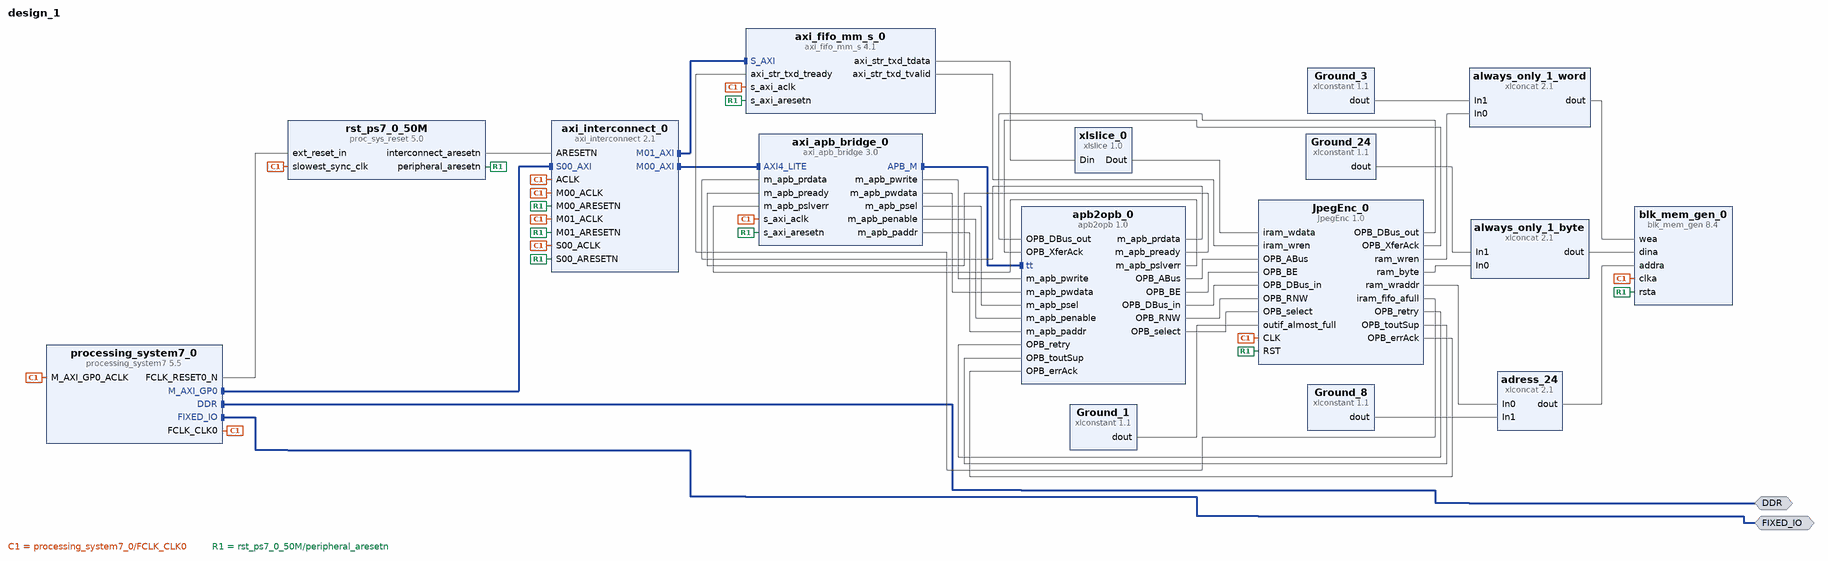
[diagram p0: block diagram of the top level]
# Vivado block design design_1, xc7z020clg400-1, Vivado 2017.4
create_bd_design design_1

create_bd_intf_port -mode Master -vlnv xilinx.com:interface:ddrx_rtl:1.0 DDR
create_bd_intf_port -mode Master -vlnv xilinx.com:display_processing_system7:fixedio_rtl:1.0 FIXED_IO

create_bd_cell -type ip -vlnv xilinx.com:ip:processing_system7:5.5 processing_system7_0
set_property -dict [list \
  CONFIG.PCW_UIPARAM_DDR_FREQ_MHZ 533.333333 \
  CONFIG.PCW_APU_PERIPHERAL_FREQMHZ 667 \
  CONFIG.PCW_SDIO_PERIPHERAL_FREQMHZ 50 \
  CONFIG.PCW_UART_PERIPHERAL_FREQMHZ 100 \
  CONFIG.PCW_PRESET_BANK1_VOLTAGE {LVCMOS 1.8V} \
  CONFIG.PCW_UIPARAM_DDR_MEMORY_TYPE {DDR 3 (Low Voltage)} \
  CONFIG.PCW_UIPARAM_DDR_PARTNO {MT41K256M16 RE-125} \
  CONFIG.PCW_QSPI_PERIPHERAL_ENABLE 1 \
  CONFIG.PCW_QSPI_QSPI_IO {MIO 1 .. 6} \
  CONFIG.PCW_QSPI_GRP_SINGLE_SS_ENABLE 1 \
  CONFIG.PCW_QSPI_GRP_SINGLE_SS_IO {MIO 1 .. 6} \
  CONFIG.PCW_SINGLE_QSPI_DATA_MODE x4 \
  CONFIG.PCW_QSPI_GRP_FBCLK_ENABLE 1 \
  CONFIG.PCW_QSPI_GRP_FBCLK_IO {MIO 8} \
  CONFIG.PCW_ENET0_PERIPHERAL_ENABLE 1 \
  CONFIG.PCW_ENET0_ENET0_IO {MIO 16 .. 27} \
  CONFIG.PCW_ENET0_GRP_MDIO_ENABLE 1 \
  CONFIG.PCW_ENET0_GRP_MDIO_IO {MIO 52 .. 53} \
  CONFIG.PCW_ENET_RESET_ENABLE 1 \
  CONFIG.PCW_ENET_RESET_SELECT {Share reset pin} \
  CONFIG.PCW_ENET0_RESET_ENABLE 0 \
  CONFIG.PCW_SD0_PERIPHERAL_ENABLE 1 \
  CONFIG.PCW_SD0_SD0_IO {MIO 40 .. 45} \
  CONFIG.PCW_SD0_GRP_CD_ENABLE 1 \
  CONFIG.PCW_SD0_GRP_CD_IO {MIO 47} \
  CONFIG.PCW_SD0_GRP_WP_ENABLE 0 \
  CONFIG.PCW_UART1_PERIPHERAL_ENABLE 1 \
  CONFIG.PCW_UART1_UART1_IO {MIO 48 .. 49} \
  CONFIG.PCW_USB0_PERIPHERAL_ENABLE 1 \
  CONFIG.PCW_USB0_USB0_IO {MIO 28 .. 39} \
  CONFIG.PCW_USB_RESET_ENABLE 1 \
  CONFIG.PCW_USB_RESET_SELECT {Share reset pin} \
  CONFIG.PCW_USB0_RESET_ENABLE 1 \
  CONFIG.PCW_USB0_RESET_IO {MIO 46} \
  CONFIG.PCW_I2C_RESET_ENABLE 1 \
  CONFIG.PCW_GPIO_MIO_GPIO_ENABLE 1 \
  CONFIG.PCW_GPIO_MIO_GPIO_IO MIO \
] [get_bd_cells processing_system7_0]
# 296 more settings of processing_system7_0 are not shown: defaults, MIO pin electricals, DDR timing, and values the tool derives
create_bd_cell -type ip -vlnv xilinx.com:ip:axi_interconnect:2.1 axi_interconnect_0
create_bd_cell -type ip -vlnv xilinx.com:ip:axi_apb_bridge:3.0 axi_apb_bridge_0
set_property -dict {CONFIG.C_APB_NUM_SLAVES 1} [get_bd_cells axi_apb_bridge_0]
create_bd_cell -type ip -vlnv xilinx.com:ip:proc_sys_reset:5.0 rst_ps7_0_50M
create_bd_cell -type ip -vlnv xilinx.com:ip:axi_fifo_mm_s:4.1 axi_fifo_mm_s_0
set_property -dict {CONFIG.C_DATA_INTERFACE_TYPE 0 CONFIG.C_USE_RX_DATA 1 CONFIG.C_USE_TX_CTRL 0} [get_bd_cells axi_fifo_mm_s_0]
create_bd_cell -type ip -vlnv xilinx.com:ip:blk_mem_gen:8.4 blk_mem_gen_0
set_property -dict [list \
  CONFIG.Enable_32bit_Address true \
  CONFIG.Write_Width_A 32 \
  CONFIG.Write_Depth_A 8192 \
  CONFIG.Enable_A Always_Enabled \
  CONFIG.Register_PortA_Output_of_Memory_Primitives true \
  CONFIG.Use_RSTA_Pin true \
  CONFIG.use_bram_block Stand_Alone \
  CONFIG.EN_SAFETY_CKT true \
] [get_bd_cells blk_mem_gen_0]
create_bd_cell -type ip -vlnv user.org:user:apb2opb:1.0 apb2opb_0
create_bd_cell -type ip -vlnv user.org:user:JpegEnc:1.0 JpegEnc_0
create_bd_cell -type ip -vlnv xilinx.com:ip:xlslice:1.0 xlslice_0
set_property -dict {CONFIG.DIN_FROM 23 CONFIG.DOUT_WIDTH 24} [get_bd_cells xlslice_0]
create_bd_cell -type ip -vlnv xilinx.com:ip:xlconstant:1.1 Ground_3
set_property -dict {CONFIG.CONST_WIDTH 3 CONFIG.CONST_VAL 0} [get_bd_cells Ground_3]
create_bd_cell -type ip -vlnv xilinx.com:ip:xlconcat:2.1 always_only_1_word
set_property -dict {CONFIG.NUM_PORTS 2 CONFIG.IN0_WIDTH 1 CONFIG.IN1_WIDTH 3} [get_bd_cells always_only_1_word]
create_bd_cell -type ip -vlnv xilinx.com:ip:xlconcat:2.1 always_only_1_byte
set_property -dict {CONFIG.NUM_PORTS 2 CONFIG.IN0_WIDTH 8 CONFIG.IN1_WIDTH 24} [get_bd_cells always_only_1_byte]
create_bd_cell -type ip -vlnv xilinx.com:ip:xlconstant:1.1 Ground_24
set_property -dict {CONFIG.CONST_WIDTH 24 CONFIG.CONST_VAL 0} [get_bd_cells Ground_24]
create_bd_cell -type ip -vlnv xilinx.com:ip:xlconcat:2.1 adress_24
set_property -dict {CONFIG.NUM_PORTS 2 CONFIG.IN0_WIDTH 24 CONFIG.IN1_WIDTH 8} [get_bd_cells adress_24]
create_bd_cell -type ip -vlnv xilinx.com:ip:xlconstant:1.1 Ground_8
set_property -dict {CONFIG.CONST_WIDTH 8 CONFIG.CONST_VAL 0} [get_bd_cells Ground_8]
create_bd_cell -type ip -vlnv xilinx.com:ip:xlconstant:1.1 Ground_1
set_property -dict {CONFIG.CONST_WIDTH 1 CONFIG.CONST_VAL 0} [get_bd_cells Ground_1]

# ---- connections ----

connect_bd_intf_net [get_bd_intf_pins processing_system7_0/M_AXI_GP0] [get_bd_intf_pins axi_interconnect_0/S00_AXI]
connect_bd_intf_net [get_bd_intf_pins axi_apb_bridge_0/AXI4_LITE] [get_bd_intf_pins axi_interconnect_0/M00_AXI]
connect_bd_intf_net [get_bd_intf_pins axi_fifo_mm_s_0/S_AXI] [get_bd_intf_pins axi_interconnect_0/M01_AXI]
connect_bd_intf_net [get_bd_intf_pins apb2opb_0/tt] [get_bd_intf_pins axi_apb_bridge_0/APB_M]
connect_bd_intf_net [get_bd_intf_ports DDR] [get_bd_intf_pins processing_system7_0/DDR]
connect_bd_intf_net [get_bd_intf_ports FIXED_IO] [get_bd_intf_pins processing_system7_0/FIXED_IO]
connect_bd_net [get_bd_pins processing_system7_0/FCLK_CLK0] \
  [get_bd_pins rst_ps7_0_50M/slowest_sync_clk] [get_bd_pins axi_apb_bridge_0/s_axi_aclk] \
  [get_bd_pins processing_system7_0/M_AXI_GP0_ACLK] [get_bd_pins axi_fifo_mm_s_0/s_axi_aclk] [get_bd_pins blk_mem_gen_0/clka] \
  [get_bd_pins JpegEnc_0/CLK] [get_bd_pins axi_interconnect_0/ACLK] [get_bd_pins axi_interconnect_0/S00_ACLK] \
  [get_bd_pins axi_interconnect_0/M00_ACLK] [get_bd_pins axi_interconnect_0/M01_ACLK]
connect_bd_net [get_bd_pins processing_system7_0/FCLK_RESET0_N] [get_bd_pins rst_ps7_0_50M/ext_reset_in]
connect_bd_net [get_bd_pins rst_ps7_0_50M/interconnect_aresetn] [get_bd_pins axi_interconnect_0/ARESETN]
connect_bd_net [get_bd_pins rst_ps7_0_50M/peripheral_aresetn] \
  [get_bd_pins axi_apb_bridge_0/s_axi_aresetn] [get_bd_pins axi_fifo_mm_s_0/s_axi_aresetn] [get_bd_pins blk_mem_gen_0/rsta] \
  [get_bd_pins JpegEnc_0/RST] [get_bd_pins axi_interconnect_0/S00_ARESETN] [get_bd_pins axi_interconnect_0/M00_ARESETN] \
  [get_bd_pins axi_interconnect_0/M01_ARESETN]
connect_bd_net [get_bd_pins axi_fifo_mm_s_0/axi_str_txd_tvalid] [get_bd_pins JpegEnc_0/iram_wren]
connect_bd_net [get_bd_pins JpegEnc_0/iram_fifo_afull] [get_bd_pins axi_fifo_mm_s_0/axi_str_txd_tready]
connect_bd_net [get_bd_pins apb2opb_0/OPB_ABus] [get_bd_pins JpegEnc_0/OPB_ABus]
connect_bd_net [get_bd_pins apb2opb_0/OPB_BE] [get_bd_pins JpegEnc_0/OPB_BE]
connect_bd_net [get_bd_pins apb2opb_0/OPB_DBus_in] [get_bd_pins JpegEnc_0/OPB_DBus_in]
connect_bd_net [get_bd_pins apb2opb_0/OPB_RNW] [get_bd_pins JpegEnc_0/OPB_RNW]
connect_bd_net [get_bd_pins apb2opb_0/OPB_select] [get_bd_pins JpegEnc_0/OPB_select]
connect_bd_net [get_bd_pins axi_apb_bridge_0/m_apb_pwrite] [get_bd_pins apb2opb_0/m_apb_pwrite]
connect_bd_net [get_bd_pins axi_apb_bridge_0/m_apb_pwdata] [get_bd_pins apb2opb_0/m_apb_pwdata]
connect_bd_net [get_bd_pins axi_apb_bridge_0/m_apb_psel] [get_bd_pins apb2opb_0/m_apb_psel]
connect_bd_net [get_bd_pins axi_apb_bridge_0/m_apb_penable] [get_bd_pins apb2opb_0/m_apb_penable]
connect_bd_net [get_bd_pins axi_apb_bridge_0/m_apb_paddr] [get_bd_pins apb2opb_0/m_apb_paddr]
connect_bd_net [get_bd_pins JpegEnc_0/OPB_DBus_out] [get_bd_pins apb2opb_0/OPB_DBus_out]
connect_bd_net [get_bd_pins JpegEnc_0/OPB_XferAck] [get_bd_pins apb2opb_0/OPB_XferAck]
connect_bd_net [get_bd_pins JpegEnc_0/OPB_retry] [get_bd_pins apb2opb_0/OPB_retry]
connect_bd_net [get_bd_pins JpegEnc_0/OPB_toutSup] [get_bd_pins apb2opb_0/OPB_toutSup]
connect_bd_net [get_bd_pins JpegEnc_0/OPB_errAck] [get_bd_pins apb2opb_0/OPB_errAck]
connect_bd_net [get_bd_pins apb2opb_0/m_apb_prdata] [get_bd_pins axi_apb_bridge_0/m_apb_prdata]
connect_bd_net [get_bd_pins apb2opb_0/m_apb_pready] [get_bd_pins axi_apb_bridge_0/m_apb_pready]
connect_bd_net [get_bd_pins apb2opb_0/m_apb_pslverr] [get_bd_pins axi_apb_bridge_0/m_apb_pslverr]
connect_bd_net [get_bd_pins axi_fifo_mm_s_0/axi_str_txd_tdata] [get_bd_pins xlslice_0/Din]
connect_bd_net [get_bd_pins xlslice_0/Dout] [get_bd_pins JpegEnc_0/iram_wdata]
connect_bd_net -net xlconcat_0_dout [get_bd_pins always_only_1_word/dout] [get_bd_pins blk_mem_gen_0/wea]
connect_bd_net [get_bd_pins JpegEnc_0/ram_wren] [get_bd_pins always_only_1_word/In0]
connect_bd_net -net always_only_1_word1_dout [get_bd_pins always_only_1_byte/dout] [get_bd_pins blk_mem_gen_0/dina]
connect_bd_net [get_bd_pins JpegEnc_0/ram_byte] [get_bd_pins always_only_1_byte/In0]
connect_bd_net [get_bd_pins Ground_3/dout] [get_bd_pins always_only_1_word/In1]
connect_bd_net -net xlconstant_0_dout [get_bd_pins Ground_24/dout] [get_bd_pins always_only_1_byte/In1]
connect_bd_net [get_bd_pins JpegEnc_0/ram_wraddr] [get_bd_pins adress_24/In0]
connect_bd_net -net xlconcat_0_dout1 [get_bd_pins adress_24/dout] [get_bd_pins blk_mem_gen_0/addra]
connect_bd_net [get_bd_pins Ground_8/dout] [get_bd_pins adress_24/In1]
connect_bd_net -net Ground_4_dout [get_bd_pins Ground_1/dout] [get_bd_pins JpegEnc_0/outif_almost_full]

# ---- address map ----
assign_bd_address -offset 0x43C00000 -range 64K -target_address_space [get_bd_addr_spaces processing_system7_0/Data] [get_bd_addr_segs axi_fifo_mm_s_0/S_AXI/Mem0]
assign_bd_address -offset 0x43C10000 -range 64K -target_address_space [get_bd_addr_spaces processing_system7_0/Data] [get_bd_addr_segs apb2opb_0/tt/i]

validate_bd_design
save_bd_design
